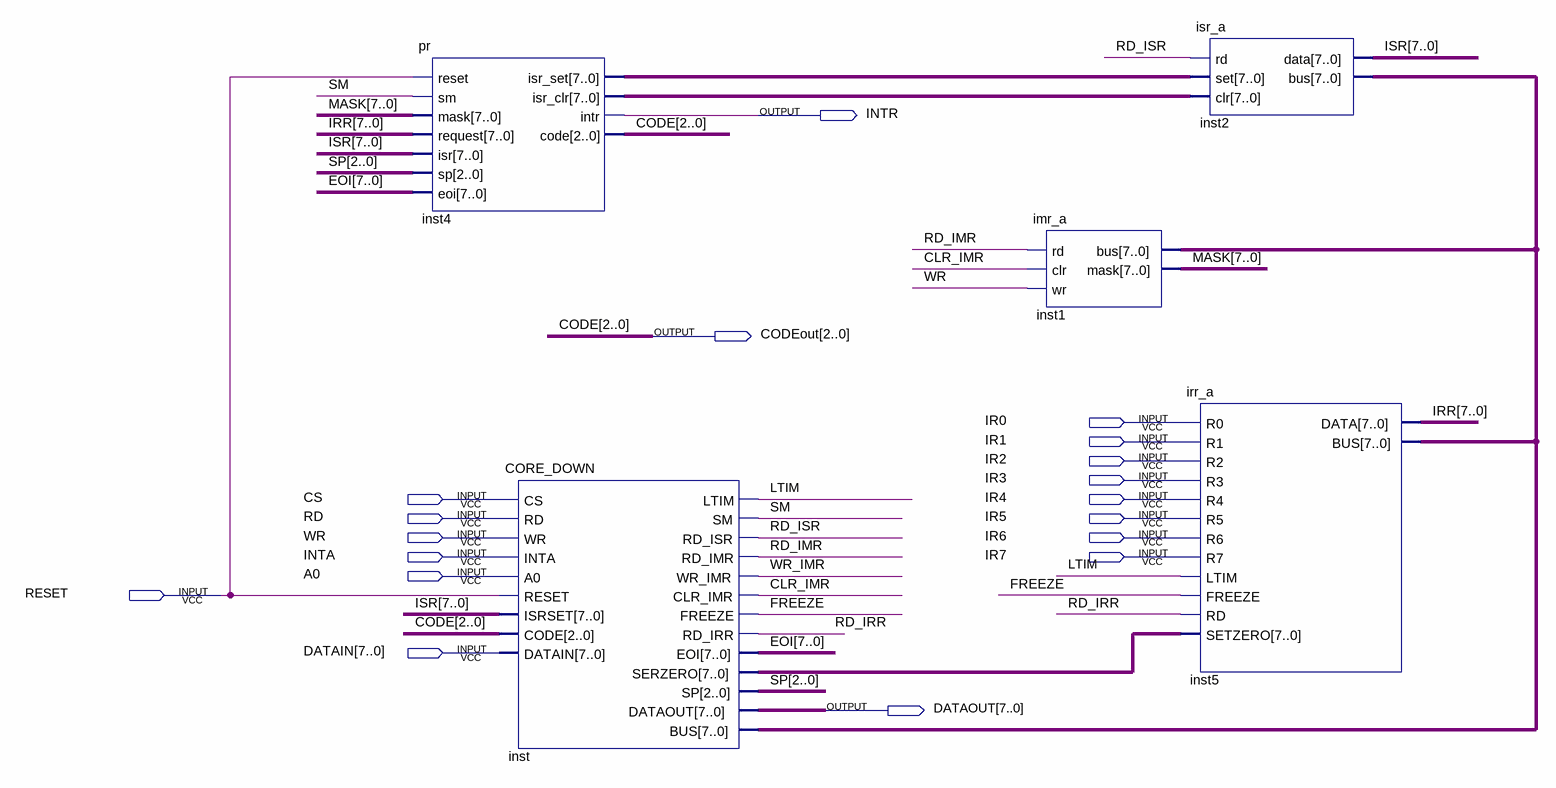
[diagram p0: schematic sheet]
// Quartus schematic 8259A.bdf as structural Verilog: 5 symbols, 18 pins
module \8259A  (
  input  IR0,
  input  IR1,
  input  IR2,
  input  IR3,
  input  CS,
  input  IR4,
  input  RD,
  input  IR5,
  input  WR,
  input  IR6,
  input  INTA,
  input  IR7,
  input  A0,
  input  RESET,
  input  [7:0] DATAIN,
  output INTR,
  output [2:0] CODEout,
  output [7:0] DATAOUT
);

  wire CLR_IMR, FREEZE, LTIM, RD_IMR, RD_IRR, RD_ISR, SM, WR_IMR;
  wire [2:0] SP;
  wire [7:0] EOI, inst4_isr_clr, inst4_isr_set, inst_bus, inst_serzero, IRR, ISR, MASK;

  pr inst4 (
    .reset(RESET), .sm(SM), .mask(MASK), .request(IRR), .isr(ISR), .sp(SP), .eoi(EOI),
    .isr_set(inst4_isr_set), .isr_clr(inst4_isr_clr), .intr(INTR), .code(CODEout));
  CORE_DOWN inst (
    .CS(CS), .RD(RD), .WR(WR), .INTA(INTA), .A0(A0), .RESET(RESET), .ISRSET(ISR), .CODE(CODEout),
    .DATAIN(DATAIN), .LTIM(LTIM), .SM(SM), .RD_ISR(RD_ISR), .RD_IMR(RD_IMR), .WR_IMR(WR_IMR),
    .CLR_IMR(CLR_IMR), .FREEZE(FREEZE), .RD_IRR(RD_IRR), .EOI(EOI), .SERZERO(inst_serzero), .SP(SP),
    .DATAOUT(DATAOUT), .BUS(inst_bus));
  imr_a inst1 (.rd(RD_IMR), .clr(CLR_IMR), .wr(WR), .mask(MASK), .bus(inst_bus));
  isr_a inst2 (.rd(RD_ISR), .set(inst4_isr_set), .clr(inst4_isr_clr), .data(ISR), .bus(inst_bus));
  irr_a inst5 (
    .R0(IR0), .R1(IR1), .R2(IR2), .R3(IR3), .R4(IR4), .R5(IR5), .R6(IR6), .R7(IR7), .LTIM(LTIM),
    .FREEZE(FREEZE), .RD(RD_IRR), .SETZERO(inst_serzero), .DATA(IRR), .BUS(inst_bus));

  // Other names for the same wires on the sheet: CODE[2:0] = CODEout
endmodule
